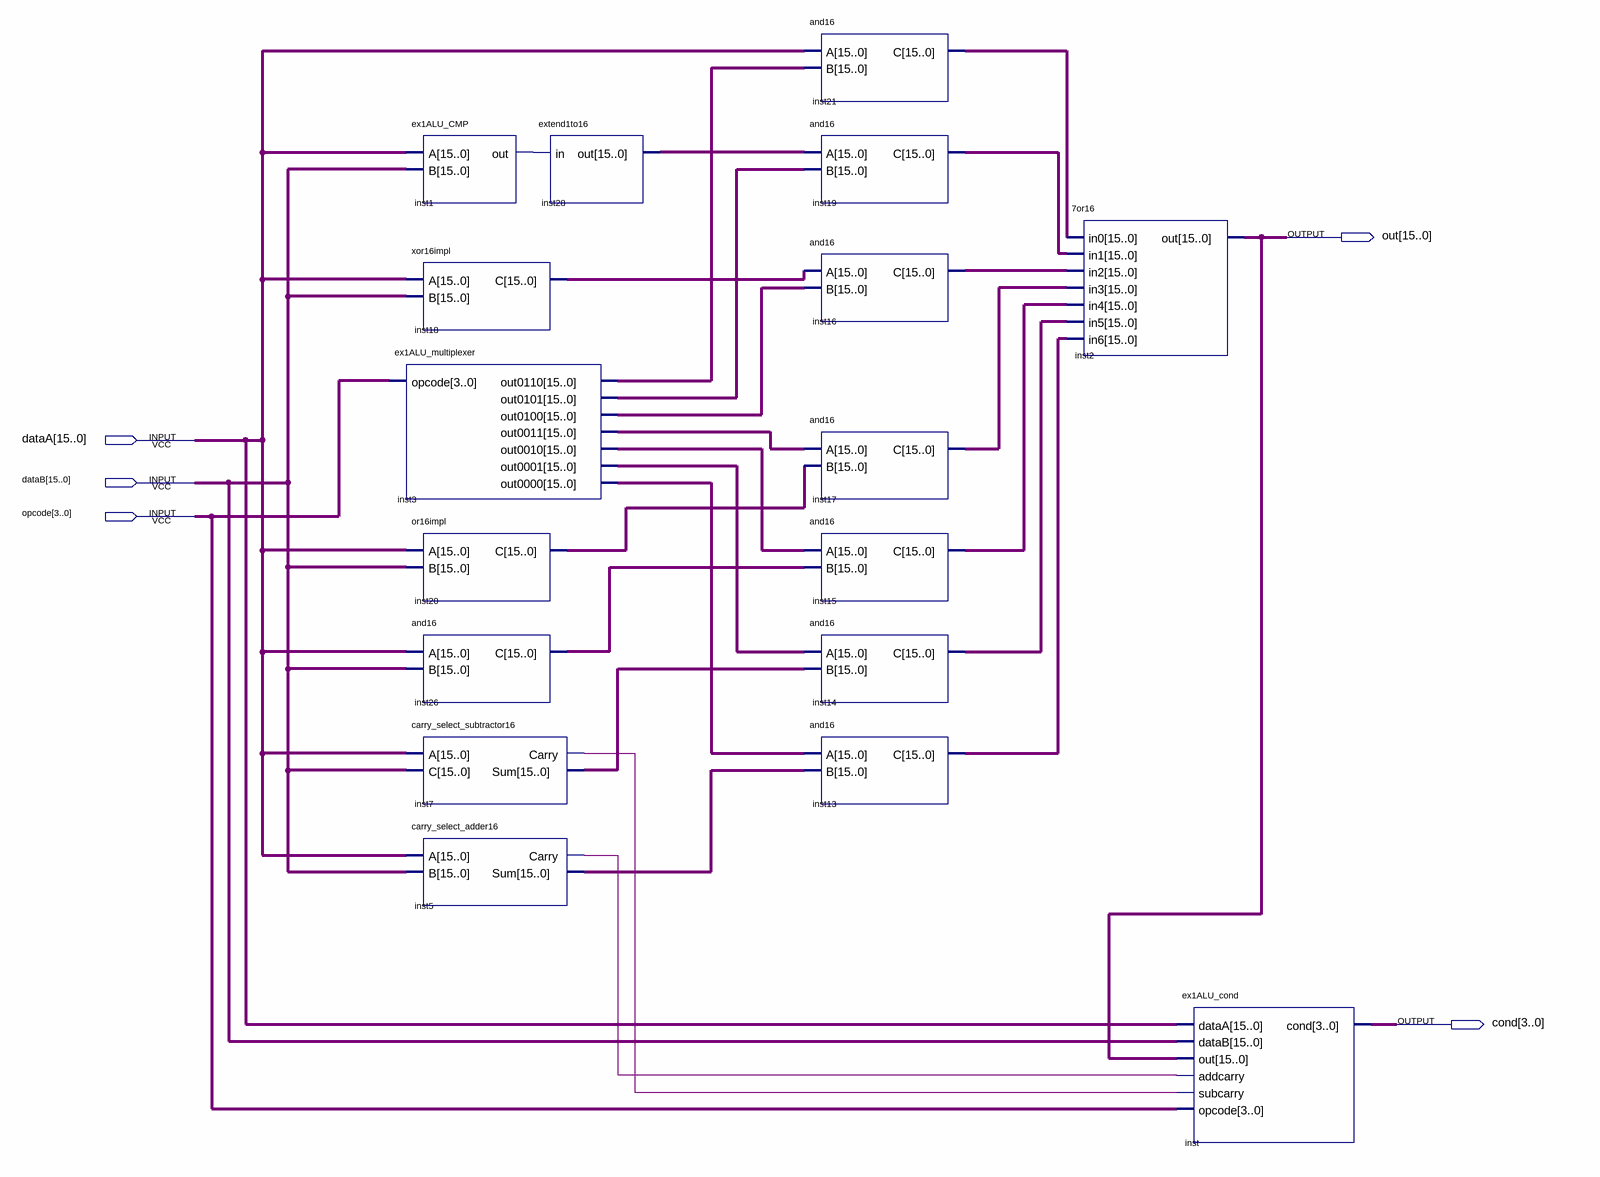
[diagram p0: schematic sheet]
// Quartus schematic ex1ALU.bdf as structural Verilog: 17 symbols, 5 pins
module ex1ALU (
  input  [15:0] dataA,
  input  [15:0] dataB,
  input  [3:0] opcode,
  output [15:0] out,
  output [3:0] cond
);

  wire inst1_out, inst5_carry, inst7_carry;
  wire [15:0] inst3_out0000, inst3_out0001, inst3_out0010, inst3_out0011, inst3_out0100, inst3_out0101,
       inst3_out0110, inst5_sum, inst7_sum, inst13_c, inst14_c, inst15_c, inst16_c, inst17_c, inst18_c,
       inst19_c, inst20_c, inst21_c, inst26_c, inst28_out;

  ex1ALU_CMP inst1 (.A(dataA), .B(dataB), .out(inst1_out));
  xor16impl inst18 (.A(dataA), .B(dataB), .C(inst18_c));
  ex1ALU_multiplexer inst3 (
    .opcode(opcode), .out0110(inst3_out0110), .out0101(inst3_out0101), .out0100(inst3_out0100),
    .out0011(inst3_out0011), .out0010(inst3_out0010), .out0001(inst3_out0001), .out0000(inst3_out0000));
  or16impl inst20 (.A(dataA), .B(dataB), .C(inst20_c));
  and16 inst26 (.A(dataA), .B(dataB), .C(inst26_c));
  carry_select_subtractor16 inst7 (.A(dataA), .C(dataB), .Carry(inst7_carry), .Sum(inst7_sum));
  carry_select_adder16 inst5 (.A(dataA), .B(dataB), .Carry(inst5_carry), .Sum(inst5_sum));
  extend1to16 inst28 (.in(inst1_out), .out(inst28_out));
  and16 inst21 (.A(dataA), .B(inst3_out0110), .C(inst21_c));
  and16 inst19 (.A(inst28_out), .B(inst3_out0101), .C(inst19_c));
  and16 inst16 (.A(inst18_c), .B(inst3_out0100), .C(inst16_c));
  and16 inst17 (.A(inst3_out0011), .B(inst20_c), .C(inst17_c));
  and16 inst15 (.A(inst3_out0010), .B(inst26_c), .C(inst15_c));
  and16 inst14 (.A(inst3_out0001), .B(inst7_sum), .C(inst14_c));
  and16 inst13 (.A(inst3_out0000), .B(inst5_sum), .C(inst13_c));
  \7or16  inst2 (
    .in0(inst21_c), .in1(inst19_c), .in2(inst16_c), .in3(inst17_c), .in4(inst15_c), .in5(inst14_c),
    .in6(inst13_c), .out(out));
  ex1ALU_cond inst (
    .dataA(dataA), .dataB(dataB), .out(out), .addcarry(inst5_carry), .subcarry(inst7_carry), .opcode(opcode),
    .cond(cond));
endmodule
